# Altium schematic sheet VELOSTAT_SENSING.SchDoc: =DocumentName
size B; SheetNumber: 6; SheetTotal: 8
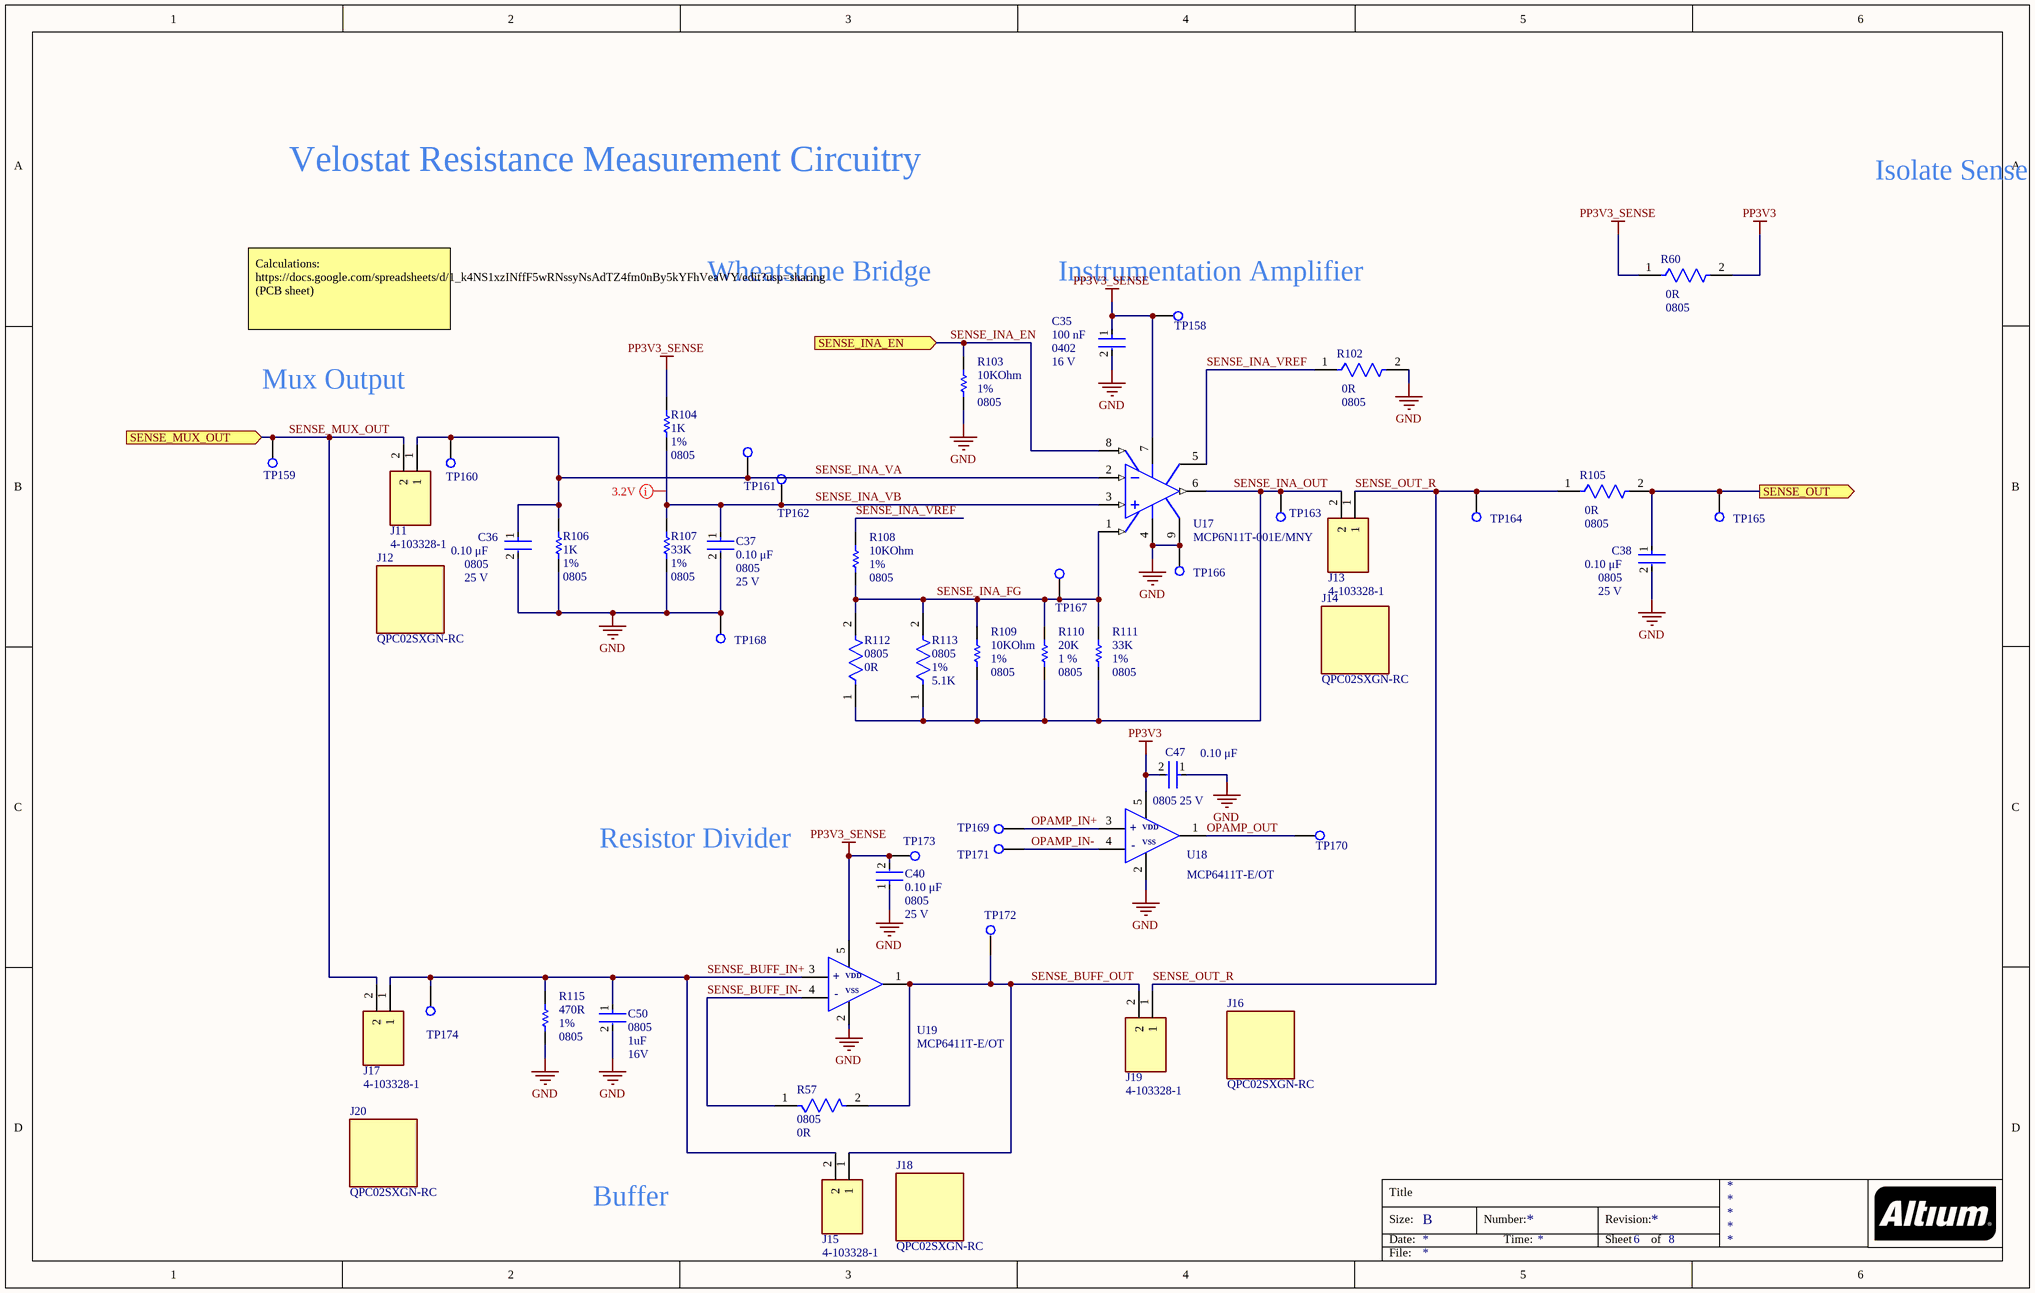
[diagram p0: VELOSTAT_SENSING.SchDoc]

## Parts
C35  Package: 0402  Voltage Rating: 16 V  Capacitance: 100 nF  [FP-CC0402-IPC_B]  (hidden comment: CC0402KRX7R7BB104)
C36  Capacitance: 0.10 μF  Package: 0805  Voltage Rating: 25 V  [FP-C0805C-DN-IPC_B]  (hidden comment: C0805C104M3RACTU)
C37  Capacitance: 0.10 μF  Package: 0805  Voltage Rating: 25 V  [FP-C0805C-DN-IPC_B]  (hidden comment: C0805C104M3RACTU)
C38  Capacitance: 0.10 μF  Package: 0805  Voltage Rating: 25 V  [FP-C0805C-DN-IPC_B]  (hidden comment: C0805C104M3RACTU)
C40  Capacitance: 0.10 μF  Package: 0805  Voltage Rating: 25 V  [FP-C0805C-DN-IPC_B]  (hidden comment: C0805C104M3RACTU)
C47  Capacitance: 0.10 μF  Package: 0805  Voltage Rating: 25 V  [FP-C0805C-DN-IPC_B]  (hidden comment: C0805C104M3RACTU)
C50  Case/Package: 0805  Capacitance: 1uF  Voltage: 16V  [FP-CL21-IPC_A]  (hidden comment: CL21B105KOFNNNE)
J11  4-103328-1  [TE_4-103328-1]
J12  QPC02SXGN-RC  [FP-QPC02SXGN-RC-MFG]
J13  4-103328-1  [TE_4-103328-1]
J14  QPC02SXGN-RC  [FP-QPC02SXGN-RC-MFG]
J15  4-103328-1  [TE_4-103328-1]
J16  QPC02SXGN-RC  [FP-QPC02SXGN-RC-MFG]
J17  4-103328-1  [TE_4-103328-1]
J18  QPC02SXGN-RC  [FP-QPC02SXGN-RC-MFG]
J19  4-103328-1  [TE_4-103328-1]
J20  QPC02SXGN-RC  [FP-QPC02SXGN-RC-MFG]
R57  Case/Package: 0805  Resistance: 0R  [FP-RMCF0805-MFG]  (hidden comment: RMCF0805ZT0R00)
R60  Case/Package: 0805  Resistance: 0R  [FP-RMCF0805-MFG]  (hidden comment: RMCF0805ZT0R00)
R102  Case/Package: 0805  Resistance: 0R  [FP-RMCF0805-MFG]  (hidden comment: RMCF0805ZT0R00)
R103  value 10KOhm  PackageReference: 0805  Tolerance: 1%  [RESC2013X60X35NL10T20]  (hidden comment: RC0805FR-0710KL)
R104  Resistance: 1K  Tolerance: 1%  Case Code (Imperial): 0805  [RESC2013X60X35ML10T20]  (hidden comment: RC0805FR-071KL)
R105  Case/Package: 0805  Resistance: 0R  [FP-RMCF0805-MFG]  (hidden comment: RMCF0805ZT0R00)
R106  Resistance: 1K  Tolerance: 1%  Case Code (Imperial): 0805  [RESC2013X60X35ML10T20]  (hidden comment: RC0805FR-071KL)
R107  value 33K  Tolerance: 1%  Package: 0805  [RESC2013X70X40LL20T20]  (hidden comment: ERJ-6GEYJ333V)
R108  value 10KOhm  PackageReference: 0805  Tolerance: 1%  [RESC2013X60X35NL10T20]  (hidden comment: RC0805FR-0710KL)
R109  value 10KOhm  PackageReference: 0805  Tolerance: 1%  [RESC2013X60X35NL10T20]  (hidden comment: RC0805FR-0710KL)
R110  value 20K  Tolerance: 1 %  Case-EIA: 0805  [RESC0805(2012)_N]  (hidden comment: 20K 1% 0805(2012))
R111  value 33K  Tolerance: 1%  Package: 0805  [RESC2013X70X40LL20T20]  (hidden comment: ERJ-6GEYJ333V)
R112  Case/Package: 0805  Resistance: 0R  [FP-RMCF0805-MFG]  (hidden comment: RMCF0805ZT0R00)
R113  Case Code (Imperial): 0805  Tolerance: 1%  Resistance: 5.1K  [FP-CRCW0805-e3-MFG]  (hidden comment: CRCW08055K10FKEA)
R115  Package Reference: 0805  Resistance Tolerance: 1%  Resistance: 470R  [RESC2013X60X35ML10T20]  (hidden comment: RC0805FR-07470RL)
TP158  RCU-0C  [TP+195X110]  (value not drawn)
TP159  RCU-0C  [TP+195X110]  (value not drawn)
TP160  RCU-0C  [TP+195X110]  (value not drawn)
TP161  RCU-0C  [TP+195X110]  (value not drawn)
TP162  RCU-0C  [TP+195X110]  (value not drawn)
TP163  RCU-0C  [TP+195X110]  (value not drawn)
TP164  RCU-0C  [TP+195X110]  (value not drawn)
TP165  RCU-0C  [TP+195X110]  (value not drawn)
TP166  RCU-0C  [TP+195X110]  (value not drawn)
TP167  RCU-0C  [TP+195X110]  (value not drawn)
TP168  RCU-0C  [TP+195X110]  (value not drawn)
TP169  RCU-0C  [TP+195X110]  (value not drawn)
TP170  RCU-0C  [TP+195X110]  (value not drawn)
TP171  RCU-0C  [TP+195X110]  (value not drawn)
TP172  RCU-0C  [TP+195X110]  (value not drawn)
TP173  RCU-0C  [TP+195X110]  (value not drawn)
TP174  RCU-0C  [TP+195X110]  (value not drawn)
U17  MCP6N11T-001E/MNY  [TDFN-MN8]
U18  MCP6411T-E/OT  [SOT95P280X145-5N]
U19  MCP6411T-E/OT  [SOT95P280X145-5N]

## Ports
SENSE_INA_EN (in), SENSE_MUX_OUT (in), SENSE_OUT (out)

## Nets
GND: C35.2 C36.2 C37.2 C38.2 C40.1 C47.1 C50.2 R102.2 R103.1 R106.1 R107.1 R115.1 TP166.1 TP168.1 U17.4(VSS) U17.9(EP) U18.2(VSS) U19.2(VSS)
PP3V3: C47.2 R60.2 U18.5(VDD)
PP3V3_SENSE: C35.1 C40.2 R60.1 R104.2 TP158.1 TP173.1 U17.7(VDD) U19.5(VDD)
OPAMP_IN+: TP169.1 U18.3(VIN+)
OPAMP_IN-: TP171.1 U18.4(VIN-)
OPAMP_OUT: TP170.1 U18.1(VOUT)
SENSE_BUFF_IN+: C50.1 J15.2 J17.1 R115.2 TP174.1 U19.3(VIN+)
SENSE_BUFF_IN-: R57.1 U19.4(VIN-)
SENSE_BUFF_OUT: J15.1 J19.2 R57.2 TP172.1 U19.1(VOUT)
SENSE_INA_EN: R103.2 U17.8(EN/~{CAL}) ; port SENSE_INA_EN
SENSE_INA_FG: R108.1 R109.2 R110.2 R111.2 R112.2 R113.2 TP167.1 U17.1(VFG)
SENSE_INA_OUT: J13.2 R109.1 R110.1 R111.1 R112.1 R113.1 TP163.1 U17.6(VOUT)
SENSE_INA_VA: C36.1 J11.1 R106.2 TP160.1 TP161.1 U17.2(VIM)
SENSE_INA_VB: C37.1 R104.1 R107.2 TP162.1 U17.3(VIP)
SENSE_INA_VREF: R102.1 R108.2 U17.5(VREF)
SENSE_MUX_OUT: J11.2 J17.2 TP159.1 ; port SENSE_MUX_OUT
SENSE_OUT: C38.1 R105.2 TP165.1 ; port SENSE_OUT
SENSE_OUT_R: J13.1 J19.1 R105.1 TP164.1

## Layout directives
mark named 3.2V: SENSE_INA_VB

## Notes on the sheet
- Velostat Resistance Measurement Circuitry
- Isolate Sense Rail from 3V3 Rail
- Wheatstone Bridge
- Instrumentation Amplifier
- Calculations: https://docs.google.com/spreadsheets/d/1_k4NS1xzINffF5wRNssyNsAdTZ4fm0nBy5kYFhVeaWY/edit?usp=sharing (PCB sheet)
- Mux Output
- Resistor Divider
- Buffer
- Title
- Size:
- Date:
- B
- Number:
- Time:
- Revision:
- Sheet
- of
- File:
- (in symbol MCP6411T-E_OT) +; -

## Library data of the parts
C35 = CMP-03422-000048-1: CAP CER 0.1UF 16V X7R 0402; Manufacturer: YAGEO; Material: Ceramic; Automotive Grade: NA; Temperature Coefficient: 30ppm/°C; Tolerance: 0.1; Value: 100 nF; Device Class L1: Passive Components; Temperature Range Low: -55°C; Device Class L3: Ceramic Capacitors; Temperature Characteristic: X7R; Ipc Land Pattern Name: CAPC10050X50; Temperature Range High: +125°C; Temperature: -55°C to +125°C; RoHS: TRUE; Automotive: No; Height: 0.55mm; Device Class L2: Capacitors; Digikey Description: CAP CER 0.1UF 16V X7R 0402; Footprint Url: http://www.yageo.com/exep/pages/download/literatures/UPY-C_GEN_24.pdf; ComponentLink2Description: Datasheet; Category: Cap; Lead Free: Yes; Octopart: https://octopart.com/cc0402krx7r7bb104-yageo-42244624; ComponentLink2URL: http://www.yageo.com/documents/recent/UPY-GP_NP0_16V-to-50V_16.pdf; Manufacturer Part Number: CC0402KRX7R7BB104; Mouser Description: 0402 0.1 uF 16 V ±10 % Tolerance X7R SMT Multilayer Ceramic Capacitor; Supplier: Digi-Key; Supplier Part Number: 311-1338-1-ND
C36-C38 C40 C47 = CMP-2007-00282-2: CAP CER 0.1UF 25V 20% X7R 0805; Manufacturer: KEMET; Temperature Coefficient: 30ppm/°C; Material: Ceramic; Tolerance: 0.2; Value: 0.10 μF; Digikey Description: CAP CER 0.1UF 25V 20% X7R 0805; Device Class L2: Capacitors; Temperature: -55°C to +125°C; Device Class L1: Passive Components; ComponentLink2Description: Datasheet; Mouser Description: Multilayer Ceramic Capacitors MLCC - SMD/SMT 25volts 0.1uF X7R 20%; Temperature Range High: +125°C; Device Class L3: Ceramic Capacitors; Automotive: No; Temperature Range Low: -55°C; RoHS: TRUE; Category: Cap; Lead Free: Yes; Ipc Land Pattern Name: CAPC200125X78; Height: 0.88mm; Temperature Characteristic: X7R; Octopart: https://octopart.com/c0805c104m3ractu-kemet-9138612; ComponentLink2URL: https://content.kemet.com/datasheets/KEM_C1003_C0G_SMD.pdf; Manufacturer Part Number: C0805C104M3RACTU; Supplier: Digi-Key; Supplier Part Number: 399-C0805C104M3RAC7800CT-ND
C50 = CMP-13271-003098-1: CL21 Series 0805 1uF 16V ±10% Tolerance X7R Multilayer Ceramic Chip Capacitor; Manufacturer: Samsung Electro-Mechanics; Width: 0.049inch; Thickness: 0.053inch; Voltage Rating: 16V; Max Operating Temperature: 125°C; Case Code (Imperial): 0805; Height: 1.25mm; Length: 2mm; Lead Free: Lead Free; Mount: Surface Mount; Tolerance: 10%; Voltage Rating (DC): 16V; Min Operating Temperature: -55°C; Contact Plating: Tin; Depth: 1.25mm; Packaging: Tape and Reel; Package Quantity: 1; Dielectric: X7R; Radiation Hardening: No; Case Code (Metric): 2012; Manufacturer Part Number: CL21B105KOFNNNE; Supplier: Digi-Key; Supplier Part Number: 1276-1026-1-ND
J11 J13 J15 J17 J19 = 4-103328-1: Connector Header Through Hole 2 position; Manufacturer: TE Connectivity AMP Connectors; MF: TE Connectivity; SnapEDA_Link: https://www.snapeda.com/parts/4-103328-1/TE%20Connectivity%20AMP%20Connectors/view-part/2384420/?ref=snap; MP: 4-103328-1; TE_purchase_URL: https://www.te.com/usa-en/product-4-103328-1.html?te_bu=Cor&te_type=disp&te_campaign=seda_glo_cor-seda-global-disp-prtnr-fy19-seda-model-bom-cta_sma-317_1&elqCampaignId=32493; Availability: Unavailable; Value: *; EU_RoHS_Compliance: Compliant; Price: None; Package: None; Supplier: Digi-Key; Supplier Part Number: A121364-ND; Manufacturer Part Number: 4-103328-1
J12 J14 J16 J18 J20 = CMP-25666-000001-1: CONN JUMPER SHORTING .100" GOLD; Manufacturer: Sullins; Conn Orientation: Straight; Pitch: 2.54mm; Current Rating: 3A; Number Of Contacts: 2; Category: Conn; Temperature Range Low: -40°C; Temperature Range High: +85°C; Device Class L1: Connectors; Lead Free: Yes; Manufacturer Part Number: QPC02SXGN-RC; Automotive: No; Height: 6.17mm; ComponentLink2URL: https://s3.amazonaws.com/catalogspreads-pdf/PAGE128-129%20.100%20JUMPER.pdf; Device Class L2: unset; Footprint Url: https://drawings-pdf.s3.amazonaws.com/11510.pdf; Device Class L3: unset; Temperature: -40°C to +85°C; RoHS: TRUE; Digikey Description: CONN JUMPER SHORTING .100" GOLD; Octopart: https://octopart.com/qpc02sxgn-rc-sullins-19878795; Package: 0; ComponentLink2Description: Datasheet; Contact Material: Gold; Supplier: Digi-Key; Supplier Part Number: S9337-ND
R57 R60 R102 R105 R112 = CMP-26527-000017-1: RES 0 OHM JUMPER 1/8W 0805; Manufacturer: Stackpole Electronics Inc; Power Rating: 125mW; Depth: 1.25mm; Length: 2mm; Military Standard: Not; Width: 0.049inch; Case Code (Imperial): 0805; Number of Terminations: 2; Mount: Surface Mount; Contact Plating: Tin; Height: 0.026inch; Min Operating Temperature: -55°C; Composition: Thick Film; Max Operating Temperature: 155°C; Packaging: Tape and Reel; Features: Automotive AEC-Q200; Max Power Dissipation: 125mW; Radiation Hardening: No; Lead Free: Lead Free; Case Code (Metric): 2012; Supplier: Digi-Key; Supplier Part Number: RMCF0805ZT0R00CT-ND; Manufacturer Part Number: RMCF0805ZT0R00
R103 R108 R109 = CMP-1659-00013-4: Chip Resistor, 10 KOhm, +/- 1%, 0.125 W, -55 to 155 degC, 0805 (2012 Metric), RoHS, Tape and Reel; Manufacturer: Yageo; Voltage Rating: 150 V; Mount: Surface Mount; ComponentLink1Description: Manufacturer URL; ComponentLink2URL: http://www.yageo.com/documents/recent/PYu-RC_Group_51_RoHS_L_04.pdf; Pins: 2; Length: 2 mm; Min Operating Temperature: -55 degC; Height: 0.5 mm; Mounting Technology: Surface Mount; RoHSCompliant: true; REACH SVHC: No SVHC; ComponentLink1URL: http://www.yageo.com/; Max Operating Temperature: 155 degC; DatasheetVersion: Rev. 4, 02/2016; Package Quantity: 5000; Packaging: Tape and Reel; ComponentLink2Description: Datasheet; PackageDescription: 2-Pin Surface Mounted Device, Body 2 x 1.25 mm; Manufacturer Part Number: RC0805FR-0710KL; Supplier: Digi-Key; Supplier Part Number: RC0805FR-0710KL
R104 R106 = CMP-2100-03671-1: Chip Resistor, 1 KOhm, +/- 1%, 125 mW, -55 to 155 degC, 0805 (2012 Metric), RoHS, Tape and Reel; Manufacturer: Yageo; Temperature Coefficient: 100ppm/degreesC; Voltage Rating (DC): 150V; Max Power Dissipation: 125mW; Number of Pins: 2; Number of Terminations: 2; Datasheet URL: http://www.yageo.com/NewPortal/yageodocoutput?fileName=/pdf/R-Chip/PYu-RC_Group_51_RoHS_L_5.pdf; Length: 0.079inch; Package Description: 2-Pin Surface Mounted Device, Body 2 x 1.25 mm; Depth: 1.25mm; Height: 0.024inch; Military Standard: Not; Case/Package: 0805; Package Reference: 0805; RoHSCompliant: true; Lead Free: LeadFree; Packaging: TapeandReel; Package Quantity: 1; Datasheet Version: Rev. 5, 10/2016; Min Operating Temperature: -55degC; Voltage Rating: 150V; Composition: ThickFilm; Power Rating: 125mW; Width: 0.049inch; Case Code (Metric): 2012; Manufacturer URL: http://www.yageo.com/; Max Operating Temperature: 155degC; REACH SVHC: Unknown; Termination: SMD/SMT; Manufacturer Part Number: RC0805FR-071KL; Supplier: Digi-Key; Supplier Part Number: 311-1.00KCRCT-ND
R107 R111 = CMP-2001-00401-1: Manufacturer: Panasonic; Part Number: ERJ-6GEYJ333V; Supplier: Digi-Key; Supplier Part Number: P33KACT-ND; Manufacturer Part Number: ERJ-6GEYJ333V
R110 = CMP-1013-00655-1: 20K 0.125W 1% 0805 (2012 Metric)  SMD; Manufacturer Part Number: RC0805FR-0720KL; Manufacturer: YAGEO; Case-Metric: 2012; Power: 0.125 W; Technology: SMT; Supplier: Digi-Key; Supplier Part Number: 311-20.0KCRCT-ND
R113 = CMP-2001-04024-2: RES Thick Film, 5.1kΩ, 1%, 0.125W, 100ppm/°C, 0805; Manufacturer: Vishay Dale; Manufacturer Part Number: CRCW08055K10FKEAC; Power Rating: 125mW; Voltage Rating (DC): 150V; Packaging: Tape and Reel; Case Code (Metric): 2012; Contact Plating: Tin; Depth: 1.25mm; Width: 0.049inch; Temperature Coefficient: 100ppm/°C; Max Power Dissipation: 125mW; Military Standard: Not; Lead Free: Lead Free; Mount: Surface Mount; Min Operating Temperature: -55°C; Package Quantity: 10; Weight: 0.000194oz; Height: 0.45mm; Number of Terminations: 2; Max Operating Temperature: 155°C; Termination: SMD/SMT; Case/Package: 0805; Composition: Thick Film; Voltage Rating: 150V; Length: 2mm; Features: Automotive AEC-Q200; Radiation Hardening: No; Supplier: Digi-Key; Supplier Part Number: 541-CRCW08055K10FKEACCT-ND
R115 = CMP-2000-06961-1: Chip Resistor, 470 Ohm, +/- 1%, 125 mW, -55 to 155 degC, 0805 (2012 Metric), RoHS, Tape and Reel; Manufacturer: Yageo; Power Rating: 250mW; Resistor Case Style: 0805[2012Metric]; Voltage Rating: 150V; Resistor Element Type: ThickFilm; Temperature Coefficient: ±100ppm/°C; SVHC: ToBeAdvised; Datasheet Version: Rev. 7, 05/2017; Automotive Qualification Standard: -; Mounting Technology: SurfaceMount; Product Range: -; Packaging: Tape&Reel; Package Description: 2-Pin Surface Mounted Device, Body 2 x 1.25 mm; MSL: MSL1-Unlimited; Datasheet URL: http://www.yageo.com/documents/recent/PYu-RC_Group_51_RoHS_L_7.pdf; Manufacturer URL: http://www.yageo.com/; Supplier: Digi-Key; Supplier Part Number: 311-470CRCT-ND; Manufacturer Part Number: RC0805FR-07470RL
TP158-TP174 = RCU-0C: Natural PC Test Point , Plating Surface Mount Mounting Type; Manufacturer: TE Connectivity AMP Connectors; Value: *; Package: SON-6 TE Connectivity AMP Connectors; Purchase-URL: https://pricing.snapeda.com/search/part/RCU-0C/?ref=eda; Supplier Part Number: A106145CT-ND; Check_prices: https://www.snapeda.com/parts/RCU-0C/TE%20Connectivity/view-part/4791537/?ref=eda; Manufacturer Part Number: RCU-0C; SnapEDA_Link: https://www.snapeda.com/parts/RCU-0C/TE%20Connectivity/view-part/4791537/?ref=snap; Supplier: Digi-Key
U17 = CMP-0187-00751-2: None; Manufacturer: Microchip Technology; Supply Current: 800uA; Max Supply Voltage: 5.5V; Number of Circuits: 1; Input Offset Voltage (Vos): 3mV; Number of Elements: 2; Power Supply Rejection Ratio (PSRR): 62dB; Common Mode Rejection Ratio: 70dB; Unity Gain Bandwidth Product: 500kHz; Slew Rate: 9V/µs; Min Supply Voltage: 1.8V; Input Bias Current: 10pA; Height: 0.75mm; Number of Pins: 8; Min Operating Temperature: -40°C; Lead Free: Lead Free; Number of Channels: 1; REACH SVHC: No SVHC; Max Supply Current: 800uA; Gain Bandwidth Product: 500kHz; Bandwidth: 500kHz; RoHS Compliant: Yes; Length: 3mm; Number of Amplifiers: 1; Package Quantity: 3300; Width: 2mm; Mount: Surface Mount; Radiation Hardening: No; Case/Package: SOIC; Input Offset Voltage-Max: 3mV; Max Operating Temperature: 125°C; Packaging: Tape and Reel; Nominal Supply Current: 800uA; Supplier: Digi-Key; Supplier Part Number: MCP6N11T-001E/MNYCT-ND; Manufacturer Part Number: MCP6N11T-001E/MNY
U18 U19 = MCP6411T-E_OT: IC OPAMP GP 1 CIRCUIT SOT23-5; Manufacturer: Microchip; Datasheet Link: http://ww1.microchip.com/downloads/en/DeviceDoc/20005791B.pdf; Height: 1.45mm; Manufacturer Part Number: MCP6411T-E/OT; Mouser Part Number: 579-MCP6411T-E/OT; Mouser Price/Stock: https://www.mouser.com/Search/Refine.aspx?Keyword=579-MCP6411T-E%2FOT; Arrow Part Number: MCP6411T-E/OT; Arrow Price/Stock: https://www.arrow.com/en/products/mcp6411t-eot/microchip-technology; Supplier: Digi-Key; Supplier Part Number: MCP6411T-E/OTCT-ND